# Altium schematic sheet Nebulizer_medical.SchDoc
size A3; SheetNumber: 2; SheetTotal: 4
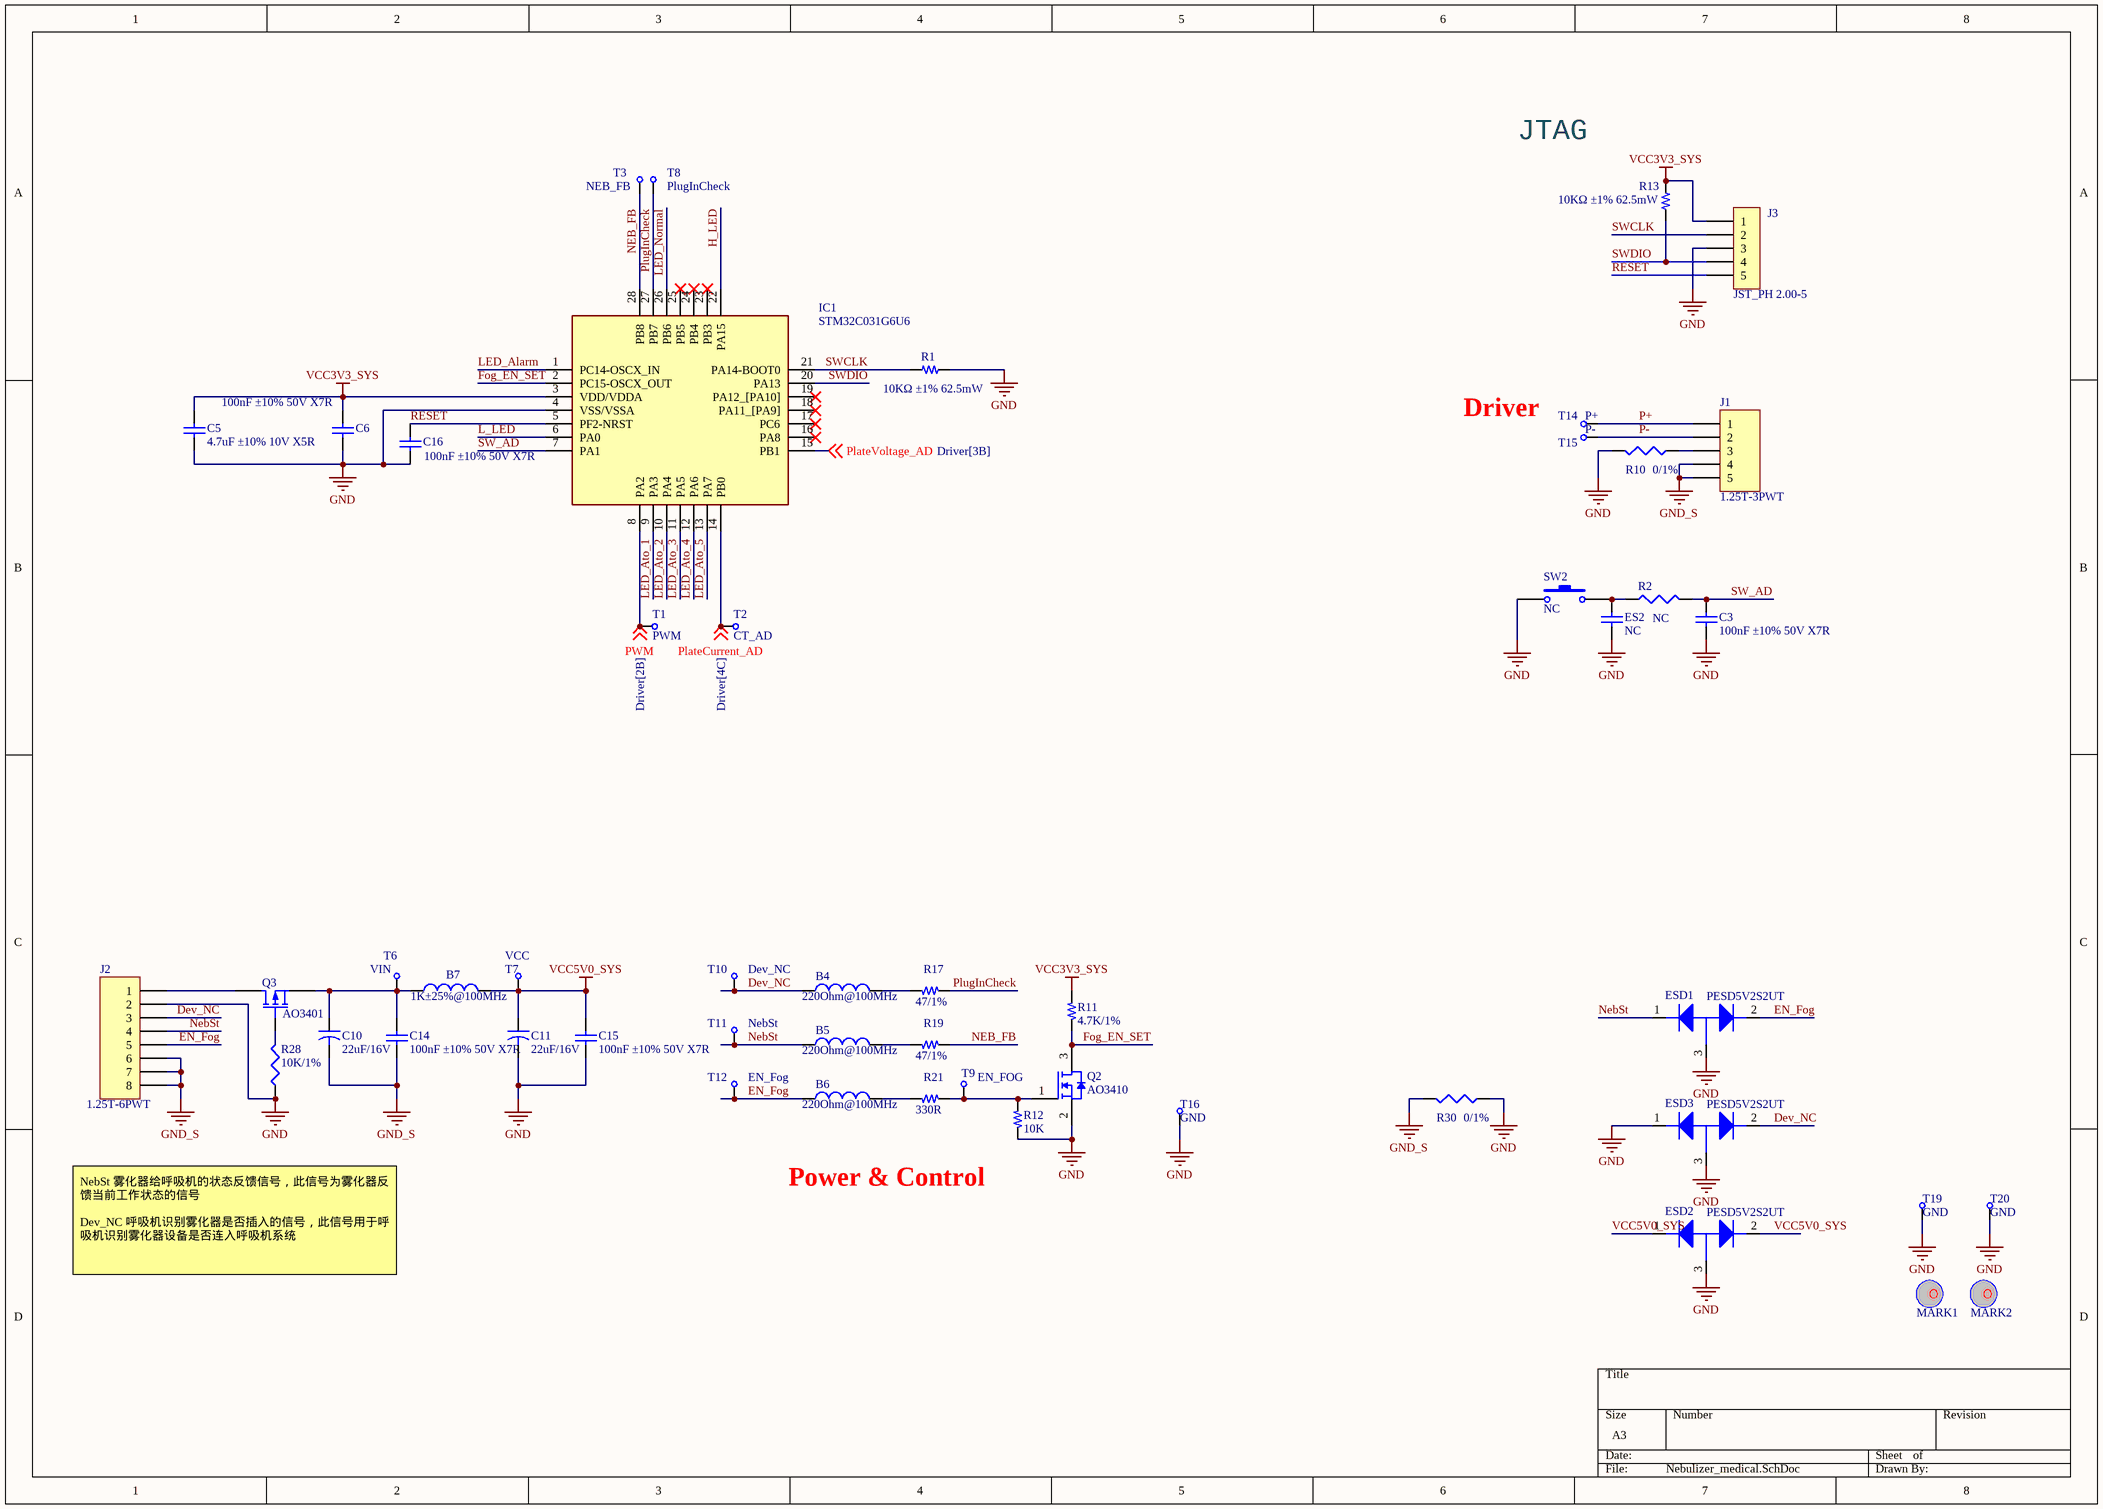
[diagram p0: Nebulizer_medical.SchDoc]

## Parts
B4  220Ohm@100MHz  [0402-B]
B5  220Ohm@100MHz  [0402-B]
B6  220Ohm@100MHz  [0402-B]
B7  1K±25%@100MHz  [0805-B]
C3  100nF ±10% 50V X7R  [C0402]
C5  4.7uF ±10% 10V X5R  [C0402]
C6  100nF ±10% 50V X7R  [C0402]
C10  22uF/16V  [C0805]
C11  22uF/16V  [C0805]
C14  100nF ±10% 50V X7R  [C0402]
C15  100nF ±10% 50V X7R  [C0402]
C16  100nF ±10% 50V X7R  [C0402]
ES2  NC  [C0402]
ESD1  PESD5V2S2UT  [SOT23]
ESD2  PESD5V2S2UT  [SOT23]
ESD3  PESD5V2S2UT  [SOT23]
IC1  STM32C031G6U6  [QFN50P400X400X60-28N-D]
J1  1.25T-3PWT  [WAFER_1.25MMX3P_180]
J2  1.25T-6PWT  [WAFER_1.25MMX6P_180]
J3  JST_PH 2.00-5  [JST_PH 2.00-5]
MARK1  MARK_POINT  [MARK_POINT]  (value not drawn)
MARK2  MARK_POINT  [MARK_POINT]  (value not drawn)
Q2  AO3410  [SOT23-3]
Q3  AO3401  [SOT23]
R1  10KΩ ±1% 62.5mW  [R0402]
R2  NC  [R0402]
R10  0/1%  [R0603]
R11  4.7K/1%  [R0402]
R12  10K  [R0402]
R13  10KΩ ±1% 62.5mW  [R0402]
R17  47/1%  [R0402]
R19  47/1%  [R0402]
R21  330R  [R0402]
R28  10K/1%  [R0402]
R30  0/1%  [R0603]
SW2  NC  [HTS-52MB]
T1  PWM  [TP-SIP-1-Small1]
T2  CT_AD  [TP-SIP-1-Small1]
T3  NEB_FB  [TP-SIP-1-Small1]
T6  VIN  [TP-SIP-1-Small1]
T7  VCC  [TP-SIP-1-Small1]
T8  PlugInCheck  [TP-SIP-1-Small1]
T9  EN_FOG  [TP-SIP-1-Small1]
T10  Dev_NC  [TP-SIP-1-Small1]
T11  NebSt  [TP-SIP-1-Small1]
T12  EN_Fog  [TP-SIP-1-Small1]
T14  P+  [TP-SIP-1-Small1]
T15  P-  [TP-SIP-1-Small1]
T16  GND  [TP-SIP-1-Small1]
T19  GND  [TP-SIP-1-Small1]
T20  GND  [TP-SIP-1-Small1]

## Nets
GND: C3.1 C5.1 C6.1 C11.2 C15.2 C16.1 ES2.2 ESD1.3(G) ESD2.3(G) ESD3.1(S) ESD3.3(G) IC1.4(VSS/VSSA) J2.2 J3.3 Q2.2(S) R1.1 R10.2 R12.2 R28.1 R30.1 SW2.1 T16.1 T19.1 T20.1
GND_S: C10.2 C14.2 J1.4 J1.5 J2.6 J2.7 J2.8 R30.2
VCC3V3_SYS: C5.2 C6.2 IC1.3(VDD/VDDA) J3.1 R11.1 R13.2
VCC5V0_SYS: B7.2 C11.1 C15.1 ESD2.1(S) ESD2.2(S) T7.1
Dev_NC: B4.1 ESD3.2(S) J2.3 T10.1
EN_Fog: B6.1 ESD1.2(S) J2.5 T12.1
Fog_EN_SET: IC1.2(PC15-OSCX_OUT) Q2.3(D) R11.2
H_LED: IC1.22(PA15)
L_LED: IC1.6(PA0)
LED_Alarm: IC1.1(PC14-OSCX_IN)
LED_Ato_1: IC1.9(PA3)
LED_Ato_2: IC1.10(PA4)
LED_Ato_3: IC1.11(PA5)
LED_Ato_4: IC1.12(PA6)
LED_Ato_5: IC1.13(PA7)
LED_Normal: IC1.26(PB6)
NEB_FB: IC1.28(PB8) R19.1 T3.1
NebSt: B5.1 ESD1.1(S) J2.4 T11.1
P+: J1.1 T14.1
P-: J1.2 T15.1
PlateCurrent_AD: IC1.14(PB0) T2.1 ; off-sheet PlateCurrent_AD
PlateVoltage_AD: IC1.15(PB1) ; off-sheet PlateVoltage_AD
PlugInCheck: IC1.27(PB7) R17.1 T8.1
PWM: IC1.8(PA2) T1.1 ; off-sheet PWM
RESET: C16.2 IC1.5(PF2-NRST) J3.5
SW_AD: C3.2 IC1.7(PA1) R2.2
SWCLK: IC1.21(PA14-BOOT0) J3.2 R1.2
SWDIO: IC1.20(PA13) J3.4 R13.1
NetB4_2: B4.2 R17.2
NetB5_2: B5.2 R19.2
NetB6_2: B6.2 R21.2
NetB7_1: B7.1 C10.1 C14.1 Q3.3(S) T6.1
NetES2_1: ES2.1 R2.1 SW2.2
NetJ1_3: J1.3 R10.1
NetJ2_1: J2.1 Q3.2(D)
NetQ2_1: Q2.1(G) R12.1 R21.1 T9.1
NetQ3_1: Q3.1(G) R28.2

Not connected (* = marked no-connect by the designer): IC1 16(PA8)* 17(PC6)* 18(PA11_[PA9])* 19(PA12_[PA10])* 23(PB3)* 24(PB4)* 25(PB5)*

## Notes on the sheet
- JTAG
- Driver
- Power & Control
- NebSt 雾化器给呼吸机的状态反馈信号，此信号为雾化器反馈当前工作状态的信号
  Dev_NC 呼吸机识别雾化器是否插入的信号，此信号用于呼吸机识别雾化器设备是否连入呼吸机系统

## Library data of the parts
B4-B7 = Inductor: Code_IEC: 1005; Value: 10uH; Published: 8-Jun-2000; LatestRevisionDate: 29-May-2009; LatestRevisionNote: IPC-7351 Footprint Added.; PackageReference: 0402-A; Publisher: Altium Limited; PackageDescription: Chip Inductor; Code_JEITA: 0402
C3 C14 C15 ES2 = Cap Semi: Capacitor (Semiconductor SIM Model); Value: 100pF; Published: 8-Jun-2000; LatestRevisionDate: 29-May-2009; LatestRevisionNote: IPC-7351 Footprint Added.; PackageReference: C1206; Publisher: Altium Limited; PackageDescription: Chip Capacitor
C5 = Cap: CL05A475KP5NRNC; Published: 8-Jun-2000; LatestRevisionDate: 17-Jul-2002; LatestRevisionNote: Re-released for DXP Platform.; PackageReference: RAD-0.3; Publisher: Altium Limited; PackageDescription: Radial Cap, Thru-Hole; 2 Leads; 0.3 in Pin Spacing
C6 C16 = Cap: Capacitor; Published: 8-Jun-2000; LatestRevisionDate: 17-Jul-2002; LatestRevisionNote: Re-released for DXP Platform.; PackageReference: RAD-0.3; Publisher: Altium Limited; PackageDescription: Radial Cap, Thru-Hole; 2 Leads; 0.3 in Pin Spacing
C10 C11 = Cap2: Capacitor; Value: 100pF; Published: 23-Sep-2002; PackageReference: CAPR5-4X5; Publisher: Altium Limited; PackageDescription: Capacitor; 2 Leads
ESD1-ESD3 = ESD
IC1 = STM32C031G6U6: Integrated Circuit; Manufacturer_Name: STMicroelectronics; Datasheet Link: https://www.st.com/resource/en/datasheet/stm32c031c4.pdf; Height: 0.6mm; Manufacturer_Part_Number: STM32C031G6U6; Mouser Part Number: 511-STM32C031G6U6; Mouser Price/Stock: https://www.mouser.co.uk/ProductDetail/STMicroelectronics/STM32C031G6U6?qs=IPgv5n7u5QZqRf3nOTChhw%3D%3D
J1 = Header 5: Header, 5-Pin; LatestRevisionDate: 17-Jul-2002; LatestRevisionNote: Re-released for DXP Platform.; Publisher: Altium Limited
J2 = Header 8: Header, 8-Pin; LatestRevisionDate: 17-Jul-2002; LatestRevisionNote: Re-released for DXP Platform.; Publisher: Altium Limited
J3 = JST_PH 2.00-5: 品牌：JST 型号：B5B-PH-K-S，直插，间距2.00，5pin; 名称: 插座2针，2.0间距; 制造商: JST; 物料编号: B5B-PH-K-S
Q2 = AO3410: AOS,AO3410,SOT23-3,-55~+150°C,; 名称: N-MOS AO3410; 制造商: AOS; 详细信息: AOS,AO3410,SOT23-3,-55~+150°C,
Q3 = MOSFET-P: P-Channel MOSFET; Published: 8-Jun-2000; LatestRevisionDate: 17-Jul-2002; LatestRevisionNote: Re-released for DXP Platform.; PackageVersion: 1995/1996; PackageReference: E3; Publisher: Altium Limited; PackageDescription: TO, Flat Index; 3 In-Line, Axial Leads; Body Dia. 4.6mm; Lead Dia. 0.5 mm (max)
R1 R11-R13 R17 R19 R21 = R-0603
R2 = Res3: Resistor; Value: 4.7K; Published: 8-Jun-2000; LatestRevisionDate: 29-May-2009; LatestRevisionNote: IPC-7351 Footprint Added.; PackageReference: J1-0603; Publisher: Altium Limited; PackageDescription: Chip Resistor
R10 R30 = Res3: Resistor; Value: 0; Published: 8-Jun-2000; LatestRevisionDate: 29-May-2009; LatestRevisionNote: IPC-7351 Footprint Added.; PackageReference: J1-0603; Publisher: Altium Limited; PackageDescription: Chip Resistor
R28 = Res3: Resistor; Value: 1K; Published: 8-Jun-2000; LatestRevisionDate: 29-May-2009; LatestRevisionNote: IPC-7351 Footprint Added.; PackageReference: J1-0603; Publisher: Altium Limited; PackageDescription: Chip Resistor
SW2 = SW-PB: Switch; Published: 24-Mar-1999; LatestRevisionDate: 17-Jul-2002; LatestRevisionNote: Re-released for DXP Platform.; PackageReference: SPST-2; Publisher: Altium Limited; PackageDescription: Switch; 2 Leads
T1-T3 T6-T12 T14-T16 T19 T20 = TP-SIP-1-Small